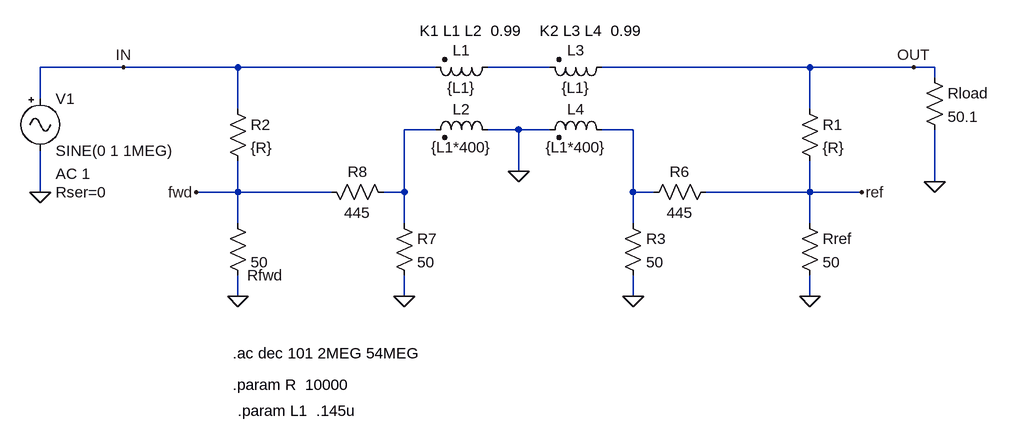
[diagram p0: schematic Cplr 1 xfmr-CT-res-divider-basic.asc]
Cplr 1 xfmr-CT-res-divider-basic.asc, the LTspice schematic file:
Version 4
SHEET 1 1724 728
WIRE -256 192 -256 144
WIRE -256 336 -256 272
WIRE -128 144 -256 144
WIRE 48 144 -128 144
WIRE 48 208 48 144
WIRE 48 336 -16 336
WIRE 48 336 48 288
WIRE 48 384 48 336
WIRE 48 496 48 464
WIRE 192 336 48 336
WIRE 304 336 272 336
WIRE 304 336 304 240
WIRE 304 384 304 336
WIRE 304 496 304 464
WIRE 352 144 48 144
WIRE 352 240 304 240
WIRE 480 240 432 240
WIRE 480 304 480 240
WIRE 528 144 432 144
WIRE 528 240 480 240
WIRE 656 240 608 240
WIRE 656 336 656 240
WIRE 656 384 656 336
WIRE 656 496 656 464
WIRE 688 336 656 336
WIRE 928 144 608 144
WIRE 928 208 928 144
WIRE 928 336 768 336
WIRE 928 336 928 288
WIRE 928 384 928 336
WIRE 928 496 928 464
WIRE 1008 336 928 336
WIRE 1088 144 928 144
WIRE 1120 144 1088 144
WIRE 1120 160 1120 144
WIRE 1120 320 1120 240
FLAG -256 336 0
FLAG 928 496 0
FLAG 1120 320 0
FLAG -128 144 IN
FLAG 1088 144 OUT
FLAG 1008 336 ref
FLAG 48 496 0
FLAG -16 336 fwd
FLAG 656 496 0
FLAG 304 496 0
FLAG 480 304 0
SYMBOL Misc\\signal -256 176 R0
WINDOW 123 24 132 Left 0
WINDOW 39 24 160 Left 0
SYMATTR Value2 AC 1
SYMATTR SpiceLine Rser=0
SYMATTR InstName V1
SYMATTR Value SINE(0 1 1MEG)
SYMBOL ind2 448 128 R90
WINDOW 0 5 56 VBottom 0
WINDOW 3 32 56 VTop 0
SYMATTR InstName L1
SYMATTR Value {L1}
SYMATTR Type ind
SYMBOL ind2 448 256 M270
WINDOW 0 32 56 VTop 0
WINDOW 3 5 56 VBottom 0
SYMATTR InstName L2
SYMATTR Value {L1*400}
SYMATTR Type ind
SYMATTR SpiceLine Rpar=975K
SYMBOL res 1104 144 R0
SYMATTR InstName Rload
SYMATTR Value 50.1
SYMBOL res 912 368 R0
SYMATTR InstName Rref
SYMATTR Value 50
SYMBOL res 912 192 R0
SYMATTR InstName R1
SYMATTR Value {R}
SYMBOL res 32 368 R0
WINDOW 0 30 96 Left 0
SYMATTR InstName Rfwd
SYMATTR Value 50
SYMBOL res 32 192 R0
SYMATTR InstName R2
SYMATTR Value {R}
SYMBOL res 640 368 R0
SYMATTR InstName R3
SYMATTR Value 50
SYMBOL res 784 320 R90
WINDOW 0 0 56 VBottom 0
WINDOW 3 32 56 VTop 0
SYMATTR InstName R6
SYMATTR Value 445
SYMBOL res 288 368 R0
SYMATTR InstName R7
SYMATTR Value 50
SYMBOL res 176 320 M90
WINDOW 0 0 56 VBottom 0
WINDOW 3 32 56 VTop 0
SYMATTR InstName R8
SYMATTR Value 445
SYMBOL ind2 624 128 R90
WINDOW 0 5 56 VBottom 0
WINDOW 3 32 56 VTop 0
SYMATTR InstName L3
SYMATTR Value {L1}
SYMATTR Type ind
SYMBOL ind2 624 256 M270
WINDOW 0 32 56 VTop 0
WINDOW 3 5 56 VBottom 0
SYMATTR InstName L4
SYMATTR Value {L1*400}
SYMATTR Type ind
SYMATTR SpiceLine Rpar=975K
TEXT 328 88 Left 0 !K1 L1 L2  0.99
TEXT 48 672 Left 0 !.param L1  .145u
TEXT 40 584 Left 0 !.ac dec 101 2MEG 54MEG
TEXT 40 632 Left 0 !.param R  10000
TEXT 512 88 Left 0 !K2 L3 L4  0.99

The netlist it stands for:
* Cplr 1 xfmr-CT-res-divider-basic.asc
V1 IN 0 SINE(0 1 1MEG) AC 1 Rser=0
L1 N002 IN {L1}
L2 0 N001 {L1*400} Rpar=975K
Rload OUT 0 50.1
Rref ref 0 50
R1 OUT ref {R}
Rfwd fwd 0 50
R2 IN fwd {R}
R3 N003 0 50
R6 ref N003 445
R7 N001 0 50
R8 fwd N001 445
L3 OUT N002 {L1}
L4 N003 0 {L1*400} Rpar=975K
K1 L1 L2  0.99
.param L1  .145u
.ac dec 101 2MEG 54MEG
.param R  10000
K2 L3 L4  0.99
.backanno
.end